# EAGLE design waterlezer (EAGLE 9.6.2)
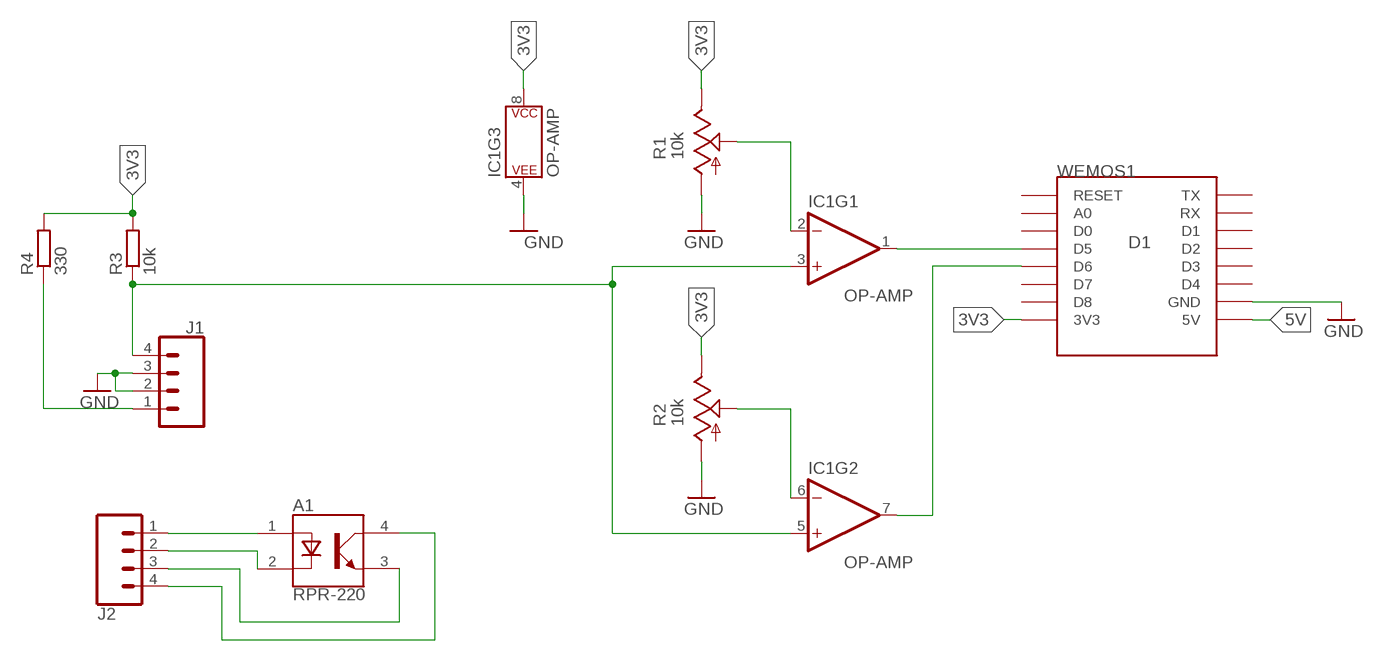
[diagram p0: schematic, sheet 1]

## Parts
A1  RPR-220  [PHODET_RPR-220]
IC1  OP-AMP  OPAMP-DUALDIP  [DIP08]
J1  CONN_04POLAR  [MOLEX-1X4]
J2  CONN_04POLAR  [MOLEX-1X4]
R1  10k  TRIM_US-S63P  [S63P]
R2  10k  TRIM_US-S63P  [S63P]
R3  10k  R-EU_0207/10  [0207/10]
R4  330  R-EU_0207/10  [0207/10]
WEMOS1  D1  WEMOS-D1-MINI  [WEMOS-D1-MINI]

## Nets
3V3 [3V3]: IC1.8(P$V+) R1.E R2.E R3.2 R4.2 WEMOS1.3V3
5V [5V]: WEMOS1.5V
GND [GND]: IC1.4(P$V-) J1.2 J1.3 R1.A R2.A WEMOS1.GND
N$1: A1.4(COLLECTOR) J2.4
N$2: A1.2(CATHODE) J2.2
N$3: J1.1 R4.1
N$4: A1.3(EMITTER) J2.3
N$6: A1.1(ANODE) J2.1
N$7: IC1.6(-IN) R2.S
N$8: IC1.2(-IN) R1.S
N$9: IC1.1(OUT) WEMOS1.D5
N$10: IC1.7(OUT) WEMOS1.D6
N$11: IC1.3(+IN) IC1.5(+IN) J1.4 R3.1
Unconnected: WEMOS1.A0 WEMOS1.D0 WEMOS1.D1 WEMOS1.D2 WEMOS1.D3 WEMOS1.D4 WEMOS1.D7 WEMOS1.D8 WEMOS1.RESET WEMOS1.RX WEMOS1.TX

## Library data of the parts
A1 = RPR-220:RPR-220: Reflective Optical Sensor 0.236" (6mm) 4-DIP Module Check prices <https://pricing.snapeda.com/parts/RPR-220/Rohm/view-part?ref=eda>; AVAILABILITY: In Stock; DESCRIPTION: Reflective Optical Sensor 0.236 (6mm) 4-DIP Module; MF: Rohm; MP: RPR-220; PACKAGE: Radial-4 Rohm; PRICE: None; PURCHASE-URL: https://pricing.snapeda.com/search/part/RPR-220/?ref=eda
IC1 = SparkFun-IC-Amplifiers:OPAMP-DUAL: Generic op-amp footprint This component is for the standard 358 pinning of a dual op-amp From the LM358 datasheet: Pin 1: Output A Pin 2: Inverting Input A Pin 3: Non-Inverting Input A Pin 4: Gnd Pin 5: Non-Inverting Input B Pin 6: Inverting Input B Pin 7: Output B Pin 8: V+; PROD_ID: NA-XXXXX
J1 J2 = SparkFun-Connectors:CONN_04: Multi connection point. Often used as Generic Header-pin footprint for 0.1 inch spaced/style header connections On any of the 0.1 inch spaced packages, you can populate with these: Break Away Headers - Straight <https://www.sparkfun.com/products/116> (PRT-00116) Break Away Male Headers - Right Angle <https://www.sparkfun.com/products/553> (PRT-00553) Female Headers <https://www.sparkfun.com/products/115> (PRT-00115) Break Away Headers - Machine Pin <https://www.sparkfun.com/products/117> (PRT-00117) Break Away Female Headers - Swiss Machine Pin <https://www.sparkfun.com/products/743> (PRT-00743) For SCREWTERMINALS and SPRING TERMINALS visit here: Screw Terimnals on SparkFun.com <https://www.sparkfun.com/search/results?term=Screw+Terminals> (5mm/3.5mm/2.54mm spacing) This device is also useful as a general connection point to wire up your design to another part of your project. Our various solder wires solder well into these plated through hole pads. Hook-Up Wire - Assortment (Stranded, 22 AWG) <https://www.sparkfun.com/products/11375> (PRT-11375) Hook-Up Wire - Assortment (Solid Core, 22 AWG) <https://www.sparkfun.com/products/11367> (PRT-11367) View the entire wire category on our website here <https://www.sparkfun.com/categories/141> Special notes: Molex polarized connector foot print use with SKU : PRT-08231 with associated crimp pins and housings. 1MM SMD Version SKU: PRT-10208; PROD_ID: CONN-08186; SF_ID: PRT-08231
R1 R2 = pot:TRIM_US-: POTENTIOMETER
R3 R4 = resistor:R-EU_: RESISTOR, European symbol
WEMOS1 = esp8266modules:WEMOS-D1-MINI: WeMos.cc D1 mini ESP8266 module

## Net classes
0 default: width 1.016 mm
1 5V: width 1.27 mm
2 12V: width 1.27 mm
3 GND: width 1.27 mm
4 3V3: width 1.27 mm

## Board
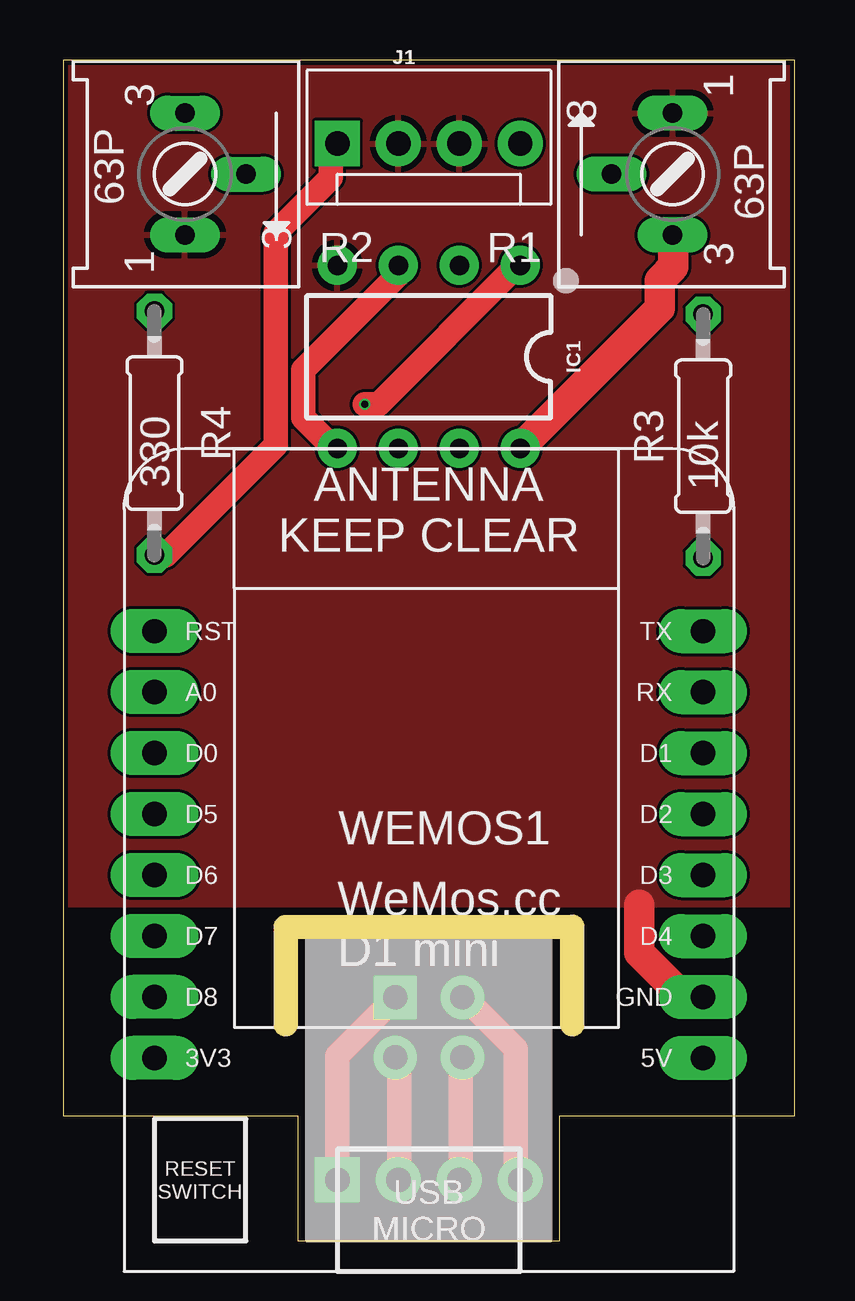
[diagram p1: board, top side]
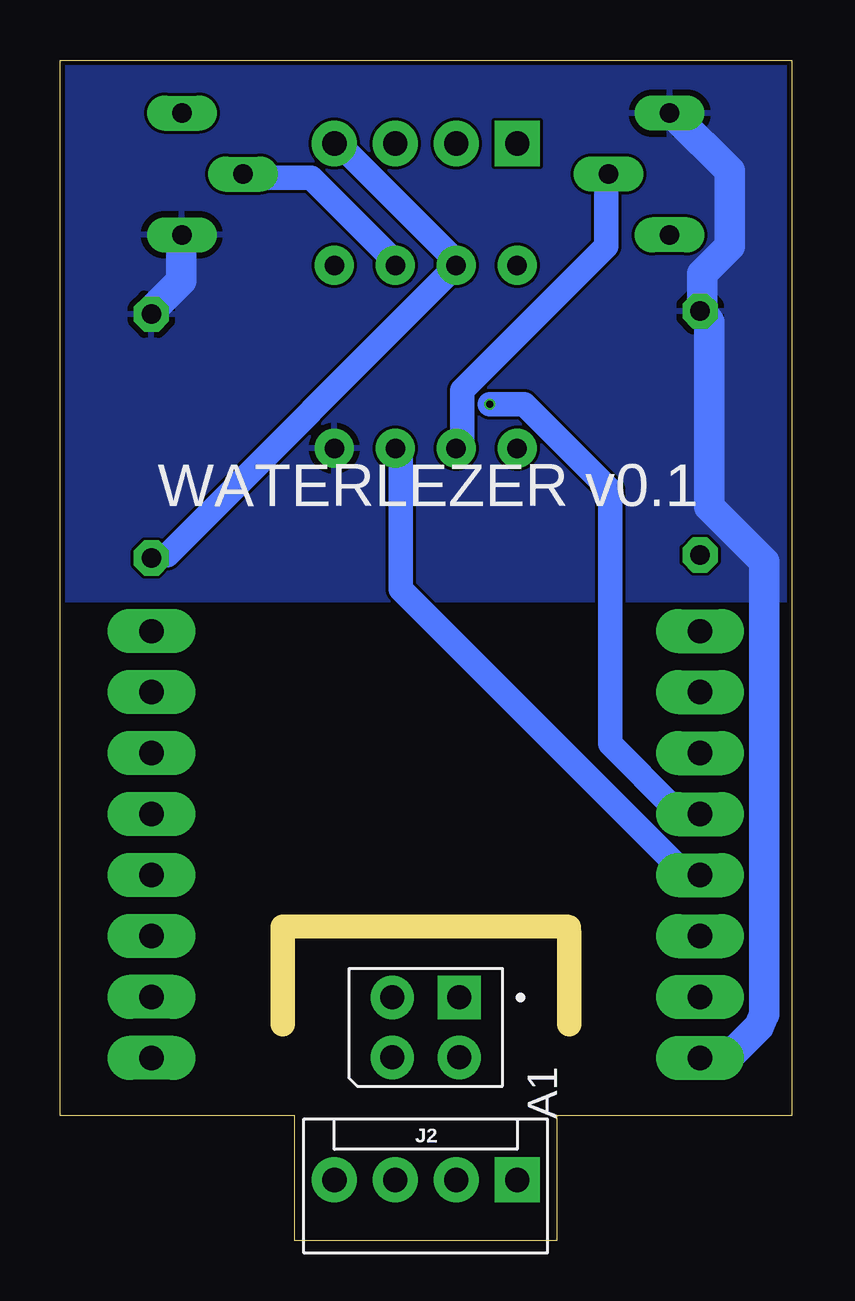
[diagram p2: board, bottom side, seen from below]

Size 30.48 x 49.2 mm. Coordinates in mm from the lower left corner, seen from the top.
Outline: 0,5.21 9.78,5.21 9.78,0 20.7,0 20.7,5.21 30.48,5.21 30.48,49.2 0,49.2 0,5.21
Copper layers (1*16): Top 0.035mm / dielectric 1.6mm / Bottom 0.035mm
Design rules "jlcpcb-2layers": minimum track width 5mil, minimum drill 0.3mm, track to track 5mil, track to pad 5mil, pad to pad 5mil, via to via 5mil, smd to smd 5mil, copper to edge 0.2mm, drill to drill 6mil, minimum pad ring 10mil, minimum via ring 3mil, stop-mask expansion 4mil, vias tented up to drill 0mil, thermal gap 10mil
Milling: 3 lines

### Footprints (pad centres in the part's own frame; a part is rotated, then mirrored left to right if it is on the bottom)
PHODET_RPR-220 = drill 1 pad 1.5 square: 1 -1.4,-1.25 | drill 1 pad 1.5: 2 -1.4,1.25; 3 1.4,1.25; 4 1.4,-1.25
DIP08 = drill 0.813 pad 1.626: 1 -3.81,-3.81; 2 -1.27,-3.81; 3 1.27,-3.81; 4 3.81,-3.81; 5 3.81,3.81; 6 1.27,3.81; 7 -1.27,3.81; 8 -3.81,3.81
MOLEX-1X4 = drill 1.016 pad 1.88 square: 1 0,0 | drill 1.016 pad 1.88: 2 2.54,0; 3 5.08,0; 4 7.62,0
S63P = drill 0.813 long: A 2.54,0; E -2.54,0; S 0,2.54
0207/10 = drill 0.813 octagon: 1 -5.08,0; 2 5.08,0
WEMOS-D1-MINI = drill 1.016 pad 1.829 long: 3V3 -10.16,-10.16; 5V 12.7,-10.16; A0 -10.16,5.08; D0 -10.16,2.54; D1 12.7,2.54; D2 12.7,0; D3 12.7,-2.54; D4 12.7,-5.08; D5 -10.16,0; D6 -10.16,-2.54; D7 -10.16,-5.08; D8 -10.16,-7.62; GND 12.7,-7.62; RESET -10.16,7.62; RX 12.7,5.08; TX 12.7,7.62

### Placement (x,y rotation side)
A1  15.24,8.89 180 bottom
IC1  15.24,36.83 180 top
J1  11.43,45.72 0 top
J2  11.43,2.54 180 bottom
R1  25.4,44.45 90 top
R2  5.08,44.45 270 top
R3  26.67,33.53 90 top
R4  3.81,33.66 90 top
WEMOS1  13.97,17.78 0 top

### Tracks (layer width: path | path; a pad name or v marks a point on that pad's centre or on a via)
3V3
  Top 1.27: IC1.8 19.14,33.15 24.86,38.86 24.86,40.01 25.43,40.58 25.43,41.72 R1.E
  Bottom 1.27: R2.E 4.86,46.86 2.57,44.58 2.57,41.43 3.71,40.29 3.71,38.86 R4.2 3.43,38.29 3.43,30.57 1.14,28.29 1.14,9.43 1.37,8.91 2.52,7.77 3.66,7.77 WEMOS1.3V3 | R1.E 25.43,41.72 25.43,40.01 26.57,38.86 R3.2
  pour Bottom: 0,49.53 0,26.67 30.48,26.67 30.48,49.53
GND
  Top 1.27: 24,14 24,12 25.72,10.29 26.57,10.29 WEMOS1.GND
  pour Top: 0,49.53 0,13.97 30.48,13.97 30.48,49.53
N$1
  Top 1.016: A1.4 16.86,10 18.86,8 18.86,2.57 J2.4
N$2
  Top 1.016: A1.2 14,7.43 14,2.57 J2.2
N$3
  Top 1.016: R4.1 4.29,28.57 8.86,33.15 8.86,42.01 11.14,44.29 11.14,45.43 J1.1
N$4
  Top 1.016: A1.3 16.57,7.43 16.57,2.57 J2.3
N$6
  Top 1.016: J2.1 11.43,7.71 13.72,10 A1.1
N$7
  Bottom 1.016: R2.S 7.71,44.29 7.71,41.43 13.72,35.43 13.72,33.15 IC1.6
N$8
  Bottom 1.016: R1.S 22.86,44.29 20,44.29 16.57,40.86 IC1.2
N$9  (via drill 0.3)
  Top 1.016: v12.57,34.86 13.14,34.86 18.86,40.58 IC1.1
  Bottom 1.016: v12.57,34.86 11.14,34.86 7.56,31.27 7.56,20.7 4.86,18 4,18 WEMOS1.D5
N$10
  Bottom 1.016: IC1.7 16.29,32.86 16.29,27.15 4.57,15.43 4,15.43 WEMOS1.D6
N$11
  Top 1.016: IC1.5 11.43,33.15 11.14,33.15 10,34.29 10,36.29 14,40.29 14,40.58 IC1.3
  Bottom 1.016: R3.1 26.57,28.57 26,28.57 14,40.58 IC1.3 14,40.86 18.86,45.72 J1.4

### Text on the board
bNames: WATERLEZER v0.1